# EAGLE schematic funcgen1 (EAGLE 9.6.2)
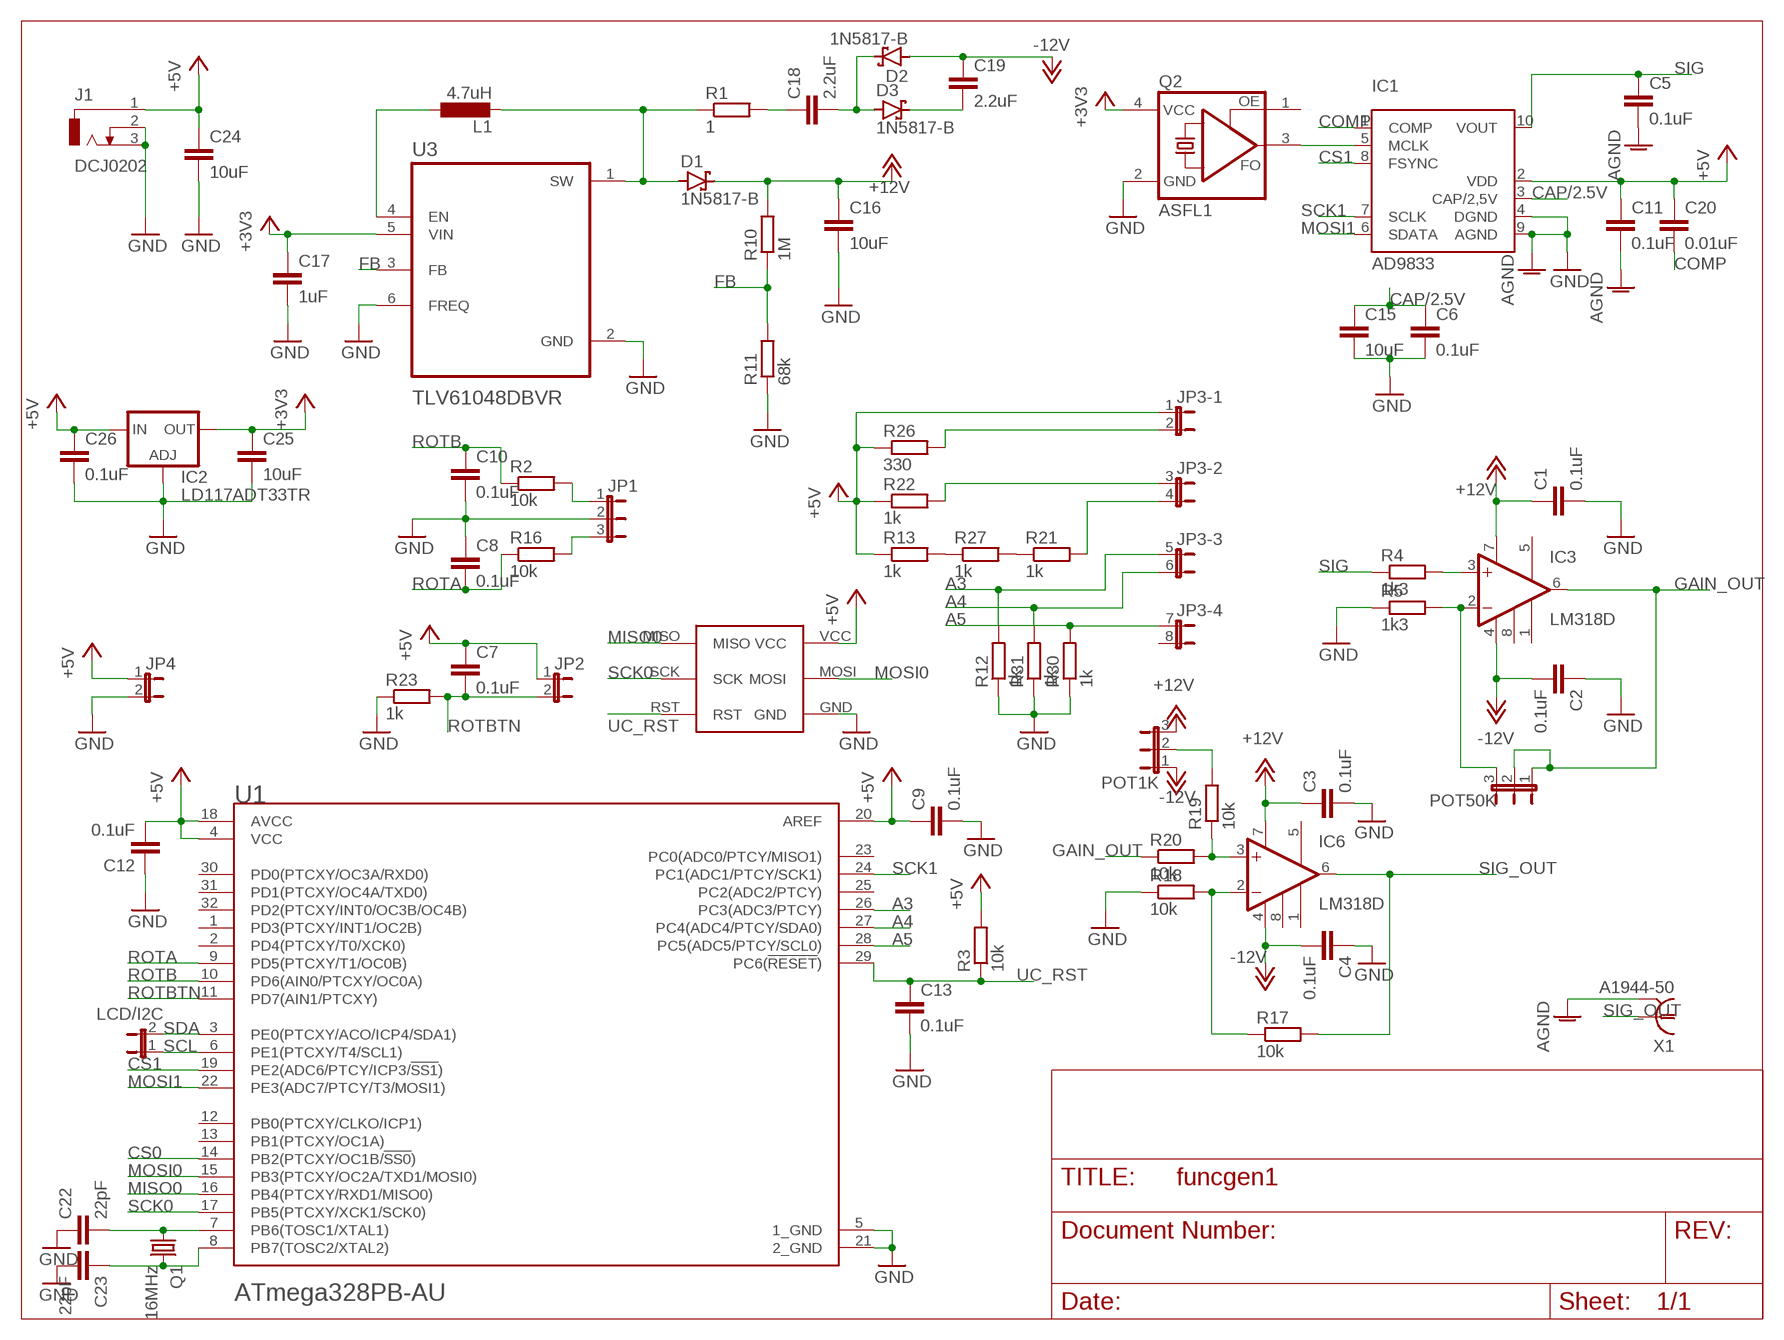
[diagram p0: schematic, sheet 1]

## Parts
C1  0.1uF  C-EUC0805  [C0805]
C2  0.1uF  C-EUC0805  [C0805]
C3  0.1uF  C-EUC0805  [C0805]
C4  0.1uF  C-EUC0805  [C0805]
C5  0.1uF  C-EUC0805  [C0805]
C6  0.1uF  C-EUC0805  [C0805]
C7  0.1uF  C-EUC0805  [C0805]
C8  0.1uF  C-EUC0805  [C0805]
C9  0.1uF  C-EUC0805  [C0805]
C10  0.1uF  C-EUC0805  [C0805]
C11  0.1uF  C-EUC0805  [C0805]
C12  0.1uF  C-EUC0805  [C0805]
C13  0.1uF  C-EUC0805  [C0805]
C15  10uF  C-EUC0805  [C0805]
C16  10uF  C-EUC0805  [C0805]
C17  1uF  C-EUC0805  [C0805]
C18  2.2uF  C-EUC0805  [C0805]
C19  2.2uF  C-EUC0805  [C0805]
C20  0.01uF  C-EUC0805  [C0805]
C22  22pF  C-EUC0805  [C0805]
C23  22pF  C-EUC0805  [C0805]
C24  10uF  C-EUC0805  [C0805]
C25  10uF  C-EUC0805  [C0805]
C26  0.1uF  C-EUC0805  [C0805]
D1  1N5817-B  [DO41-7.6]
D2  1N5817-B  [DO41-7.6]
D3  1N5817-B  [DO41-7.6]
IC1  AD9833  [MSOP10]
IC2  LD117ADT33TR  [DPACK]
IC3  LM318D  [SOIC8]
IC6  LM318D  [SOIC8]
J1  DCJ0202  [DCJ0202]
JP1  JP2E  [JP2]
JP2  JP1E  [JP1]
JP3  JP4QE  [JP4Q]
JP4  JP1E  [JP1]
L1  4.7uH  L-EUL0201  [L0201]
LCD/I2C  JP1E  [JP1]
POT1K  JP2W  [JP2W]
POT50K  JP2W  [JP2W]
Q1  16MHz  CRYSTALHC49UP  [HC49UP]
Q2  ASFL1  [ASF]
R1  1  R-EU_R0805  [R0805]
R2  10k  R-EU_R0805  [R0805]
R3  10k  R-EU_R0805  [R0805]
R4  1k3  R-EU_R0805  [R0805]
R5  1k3  R-EU_R0805  [R0805]
R10  1M  R-EU_R0805  [R0805]
R11  68k  R-EU_R0805  [R0805]
R12  1k  R-EU_R0805  [R0805]
R13  1k  R-EU_R0805  [R0805]
R16  10k  R-EU_R0805  [R0805]
R17  10k  R-EU_R0805  [R0805]
R18  10k  R-EU_R0805  [R0805]
R19  10k  R-EU_R0805  [R0805]
R20  10k  R-EU_R0805  [R0805]
R21  1k  R-EU_R0805  [R0805]
R22  1k  R-EU_R0805  [R0805]
R23  1k  R-EU_R0805  [R0805]
R26  330  R-EU_R0805  [R0805]
R27  1k  R-EU_R0805  [R0805]
R30  1k  R-EU_R0805  [R0805]
R31  1k  R-EU_R0805  [R0805]
U1  MICROCHIP_ATMEGA328PB-AUMICROCHIP_ATMEGA328PB-AU_0_0  [MICROCHIP_ATMEGA328PB-AU_0]
U3  TLV61048DBVR  [SOT95P280X145-6N]
U$1  AVR-ISP  [AVR-ISP]
X1  A1944-50  [A1944]

## Nets
+3V3: C17.1 C25.1 IC2.4(OUT) Q2.4(VCC) U3.5(VIN)
+5V: C7.1 C9.1 C11.1 C12.2 C20.1 C24.1 C26.1 IC1.2(VDD) IC2.3(IN) J1.1 JP2.1 JP3.1 JP4.1 R3.2 R13.1 R22.1 R26.1 U1.4(VCC) U1.18(AVCC) U1.20(AREF) U$1.VCC
+12V: C1.1 C3.1 C16.1 D1.C IC3.7(V+) IC6.7(V+) POT1K.3 R10.2
-12V: C2.2 C4.2 C19.1 D2.A IC3.4(V-) IC6.4(V-) POT1K.1
A3: JP3.5 R12.2 U1.26(PC3(ADC3/PTCY))
A4: JP3.6 R31.2 U1.27(PC4(ADC4/PTCY/SDA0))
A5: JP3.7 R30.2 U1.28(PC5(ADC5/PTCY/SCL0))
AGND: C5.2 C11.2 X1.2 X1.3 X1.4 X1.5
CAP/2.5V: C6.1 C15.1 IC1.3(CAP/2,5V)
COMP: C20.2 IC1.1(COMP)
CS0: U1.14(PB2(PTCXY/OC1B/!SS0!))
CS1: IC1.8(FSYNC) U1.19(PE2(ADC6/PTCY/ICP3/!SS1!))
FB: R10.1 R11.2 U3.3(FB)
GAIN_OUT: IC3.6(OUT) POT50K.1 POT50K.2 R20.1
GND: C1.2 C2.1 C3.2 C4.1 C6.2 C8.1 C9.2 C10.2 C12.1 C13.2 C15.2 C16.2 C17.2 C22.1 C23.2 C24.2 C25.2 C26.2 IC1.4(DGND) IC1.9(AGND) IC2.1(ADJ) J1.2 J1.3 JP1.2 JP4.2 Q2.2(GND) R5.1 R11.1 R12.1 R18.1 R23.1 R30.1 R31.1 U1.5(1_GND) U1.21(2_GND) U3.2(GND) U3.6(FREQ) U$1.GND ; supply symbol labelled AGND
MISO0: U1.16(PB4(PTCXY/RXD1/MISO0)) U$1.MISO
MOSI0: U1.15(PB3(PTCXY/OC2A/TXD1/MOSI0)) U$1.MOSI
MOSI1: IC1.6(SDATA) U1.22(PE3(ADC7/PTCY/T3/MOSI1))
N$1: IC3.3(+IN) R4.2
N$2: IC3.2(-IN) POT50K.3 R5.2
N$3: IC6.3(+IN) R19.1 R20.2
N$4: POT1K.2 R19.2
N$5: IC6.2(-IN) R17.1 R18.2
N$6: IC1.5(MCLK) Q2.3(FO)
N$7: C22.2 Q1.1 U1.7(PB6(TOSC1/XTAL1))
N$8: L1.1 U3.4(EN)
N$9: D1.A L1.2 R1.1 U3.1(SW)
N$10: C18.1 R1.2
N$11: C18.2 D2.C D3.A
N$12: C19.2 D3.C
N$13: JP1.1 R2.2
N$14: JP1.3 R16.2
N$15: C23.1 Q1.2 U1.8(PB7(TOSC2/XTAL2))
N$16: R21.1 R27.2
N$17: R13.2 R27.1
N$18: JP3.2 R26.2
N$19: JP3.3 R22.2
N$20: JP3.4 R21.2
ROTA: C8.2 R16.1 U1.9(PD5(PTCXY/T1/OC0B))
ROTB: C10.1 R2.1 U1.10(PD6(AIN0/PTCXY/OC0A))
ROTBTN: C7.2 JP2.2 R23.2 U1.11(PD7(AIN1/PTCXY))
SCK0: U1.17(PB5(PTCXY/XCK1/SCK0)) U$1.SCK
SCK1: IC1.7(SCLK) U1.24(PC1(ADC1/PTCY/SCK1))
SCL: LCD/I2C.1 U1.6(PE1(PTCXY/T4/SCL1))
SDA: LCD/I2C.2 U1.3(PE0(PTCXY/ACO/ICP4/SDA1))
SIG: C5.1 IC1.10(VOUT) R4.1
SIG_OUT: IC6.6(OUT) R17.2 X1.1
UC_RST: C13.1 R3.1 U1.29(PC6(!RESET!)) U$1.RST
Unconnected: IC3.1(BAL1) IC3.5(BAL2) IC3.8(COMP) IC6.1(BAL1) IC6.5(BAL2) IC6.8(COMP) JP3.8 Q2.1(OE) U1.1(PD3(PTCXY/INT1/OC2B)) U1.2(PD4(PTCXY/T0/XCK0)) U1.12(PB0(PTCXY/CLKO/ICP1)) U1.13(PB1(PTCXY/OC1A)) U1.23(PC0(ADC0/PTCY/MISO1)) U1.25(PC2(ADC2/PTCY)) U1.30(PD0(PTCXY/OC3A/RXD0)) U1.31(PD1(PTCXY/OC4A/TXD0)) U1.32(PD2(PTCXY/INT0/OC3B/OC4B))

## Library data of the parts
C1-C13 C15-C20 C22-C26 = rcl:C-EU: CAPACITOR, European symbol; SPICEPREFIX: C
D1-D3 = diode:1N581*: 1.0A SCHOTTKY BARRIER RECTIFIER Source: http://www.diodes.com/datasheets/ds23001.pdf
IC1 = AD9833:AD9833: LowPower Waveform Generator Clock Rate up to 12,5 MHz Serial Interface Low Pin Count Check prices <https://pricing.snapeda.com/search/part/AD9833/?ref=eda>; AVAILABILITY: Bad; DESCRIPTION: Direct Digital Synthesis IC 10 b 25MHz 28 b Tuning 10-MSOP; MF: Analog Devices; MP: AD9833; PACKAGE: MSOP-10 Analog Devices; PRICE: None
IC2 = v-reg:LD117A?*: Low drop fixed and adjustable positive voltage regulators 1 A Source: http://www.st.com/stonline/products/literature/ds/7194/ld1117axx.pdf
IC3 IC6 = linear:LM*18: FAST GENERAL-PURPOSE OPERATIONAL AMPLIFIER Sourde: http://focus.ti.com/lit/ds/slos063b/slos063b.pdf
J1 = con-jack:DCJ0202: DC POWER JACK Source: DCJ0202.pdf; OC_FARNELL: unknown; OC_NEWARK: unknown
JP1 = jumper:JP2E: JUMPER
JP2 JP4 LCD/I2C = jumper:JP1E: JUMPER
JP3 = jumper:JP4QE: JUMPER
L1 = rcl:L-EU: INDUCTOR, European symbol; SPICEPREFIX: L
POT1K POT50K = jumper:JP2W: JUMPER
Q1 = crystal:CRYSTAL: CRYSTAL; OC_FARNELL: unknown; OC_NEWARK: unknown
Q2 = crystal:ASF*: CRYSTAL CLOCK OSCILLATORS 5.0 Vdc or 3.3 Vdc - LOW PROFILE ULTRA MINIATURE CERAMIC SURFACE MOUNT Source: http://www.abracon.com/Oscillators/asf1-L-L1.pdf; MF: Abracon Corporation; MPN: ASFL1-125.000MHZ-EC-T; OC_FARNELL: 1838931; OC_NEWARK: 19M1882
R1-R5 R10-R13 R16-R23 R26 R27 R30 R31 = rcl:R-EU_: RESISTOR, European symbol; SPICEPREFIX: R
U1 = Microchip - ATmega328PB-AU:MICROCHIP_ATMEGA328PB-AU: ATmega328PB Summary Datasheet; CENTROID_NOT_SPECIFIED: No; DATASHEET: http://ww1.microchip.com/downloads/en/DeviceDoc/40001907A.pdf; DIGIKEY_DESCRIPTION: IC MCU 8BIT 32KB FLASH 32TQFP; DIGIKEY_PART_NUMBER: ATMEGA328PB-AU-ND; LEAD_FREE: yes; MF: Microchip; MFG_PACKAGE_IDENT: 32A; MOUSER_PART_NUMBER: 556-ATMEGA328PB-AU; MPN: ATmega328PB-AU; PACKAGE: TQFP32; PREFIX: U; ROHS: yes; TEMPERATURE_RANGE_HIGH: +85°C; TEMPERATURE_RANGE_LOW: -40°C; VOLTAGE: 5.5V
U3 = TLV61048DBVR:TLV61048DBVR: Check prices <https://pricing.snapeda.com/search/part/TLV61048DBVR/?ref=eda>; AVAILABILITY: Warning; DESCRIPTION: 14-V output voltage non-synchronous boost converter in SOT-23 package 6-SOT-23 -40 to 125; MF: Texas Instruments; MP: TLV61048DBVR; PACKAGE: SOT-23-6 Texas Instruments; PRICE: None; PURCHASE-URL: https://pricing.snapeda.com/search/part/TLV61048DBVR/?ref=eda
U$1 = AVR-ISP:AVR-ISP: Check prices <https://pricing.snapeda.com/parts/AVR-ISP/Gravitech/view-part?ref=eda>; AVAILABILITY: Bad; DESCRIPTION: Emulators / Simulators AVR USB IN CIRCUIT EMUL/PRGMR ISP; MF: Gravitech; MP: AVR-ISP; PACKAGE: None; PRICE: None
X1 = con-coax:A1944-50: BNC CONNECTOR 50 Ohm distributor Buerklin 78F2475; OC_FARNELL: unknown; OC_NEWARK: unknown